# Altium schematic sheet Schematic.SchDoc: IoT Color Detection
size B; ApprovedBy: Abbas; CheckedBy: Abbas; Author: Abbas; DrawnBy: Abbas; Revision: V1; SheetNumber: 1; SheetTotal: 1
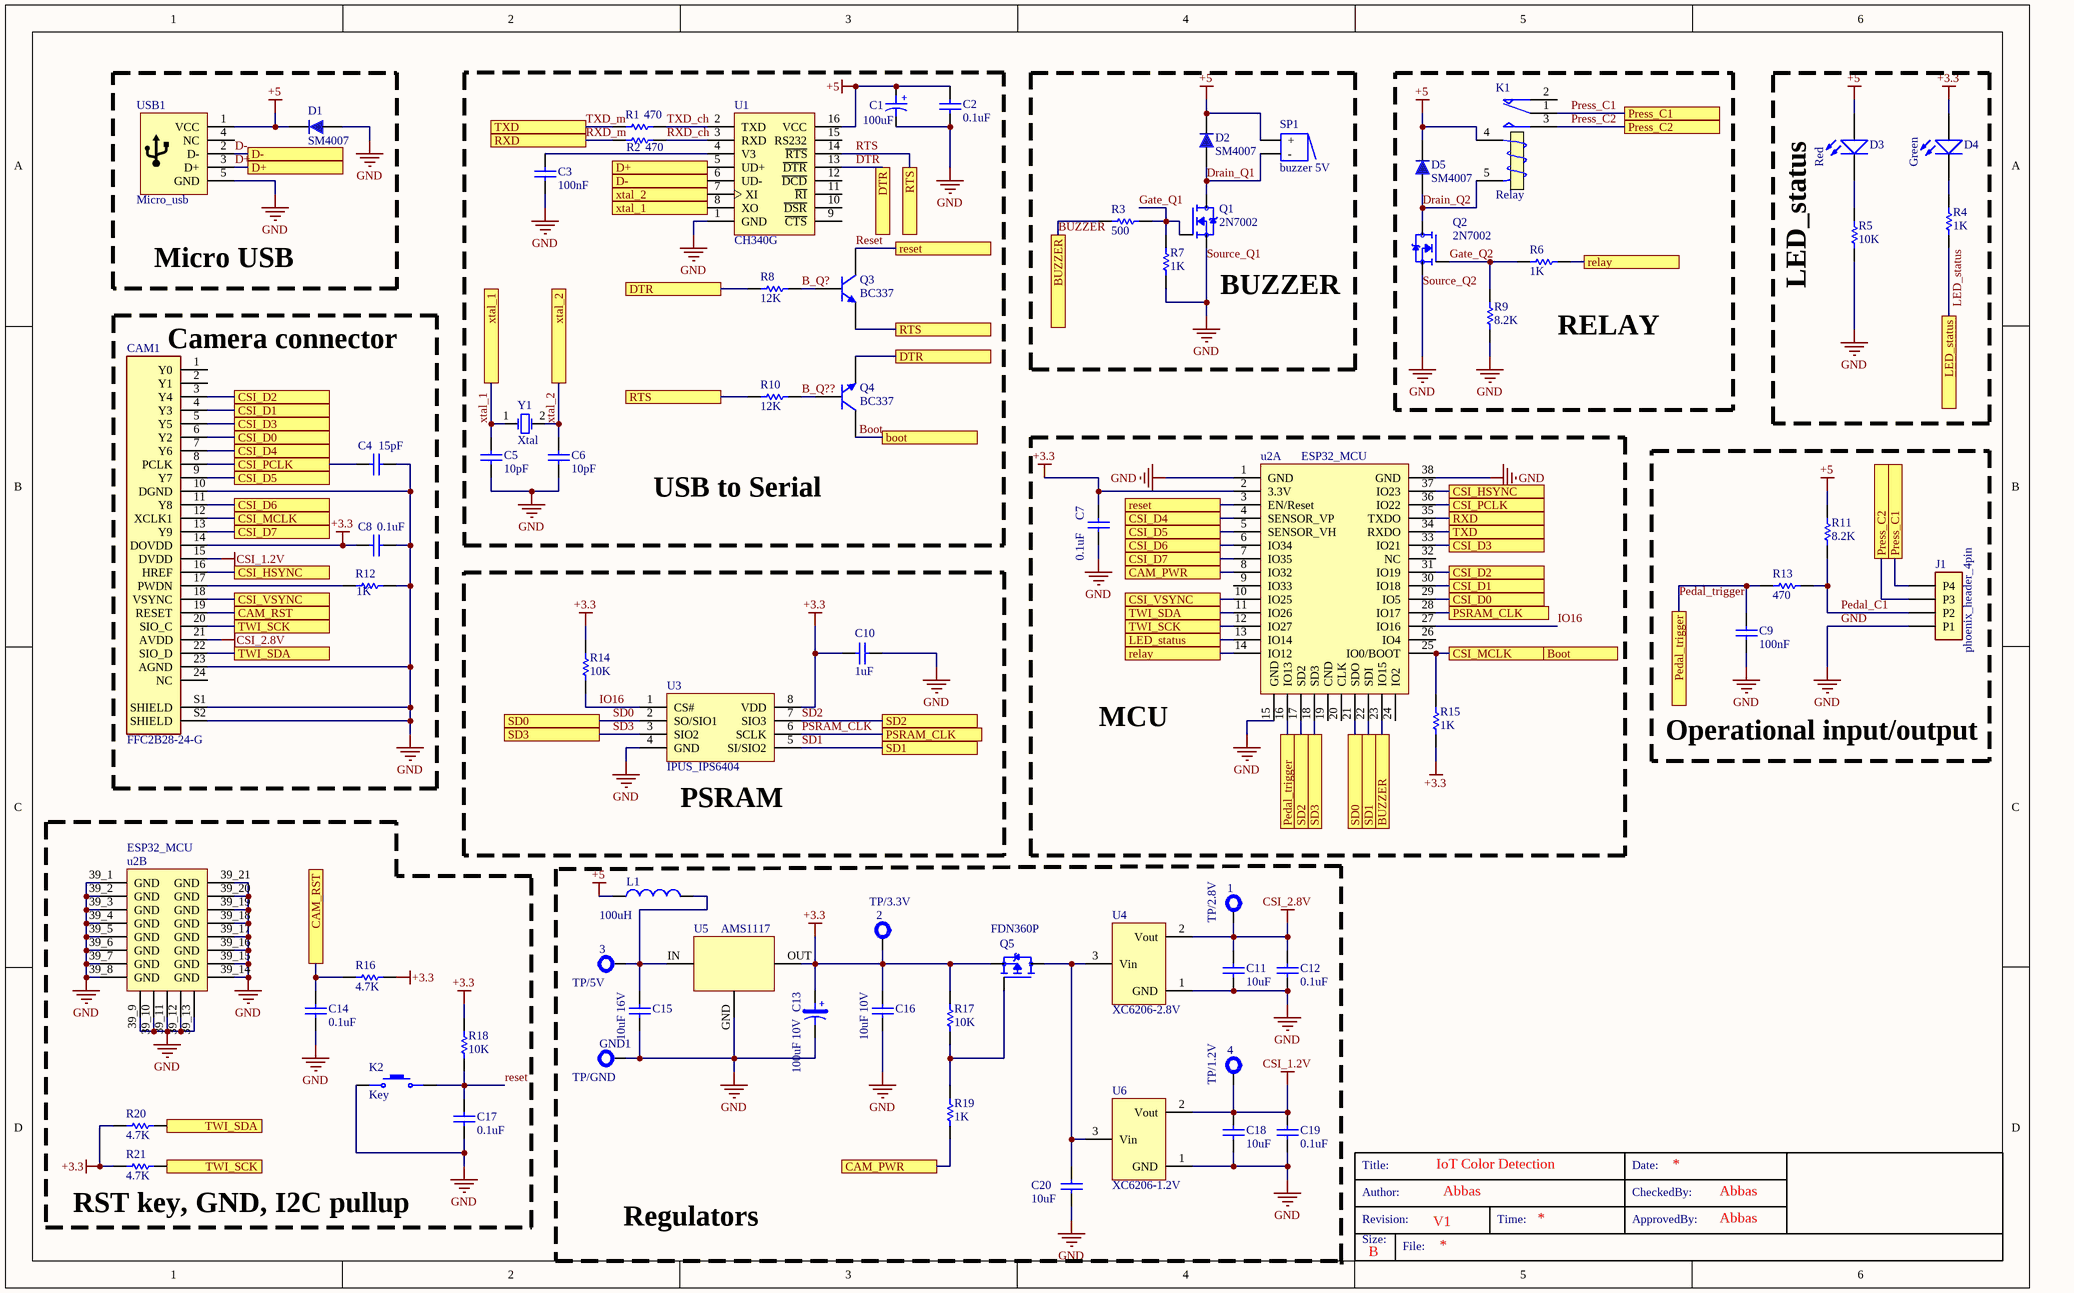
[diagram p0: Schematic.SchDoc]

## Parts
1  TP/2.8V  [test_point]
2  TP/3.3V  [test_point]
3  TP/5V  [test_point]
4  TP/1.2V  [test_point]
C1  100uF  [TH_electrolite]
C2  0.1uF  [SMD_1206]
C3  100nF  [SMD_1206]
C4  15pF  [SMD_0805]
C5  10pF  [SMD_0805]
C6  10pF  [SMD_0805]
C7  0.1uF  [SMD_1206]
C8  0.1uF  [SMD_0805]
C9  100nF  [SMD_1206]
C10  1uF  [SMD_1206]
C11  10uF  [SMD_1206]
C12  0.1uF  [SMD_1206]
C13  100uF 10V  [B size (1210)]
C14  0.1uF  [SMD_1206]
C15  10uF 16V  [SMD_1206]
C16  10uF 10V  [SMD_1206]
C17  0.1uF  [SMD_1206]
C18  10uF  [SMD_1206]
C19  0.1uF  [SMD_1206]
C20  10uF  [SMD_1206]
CAM1  FFC2B28-24-G  [FFC_24pin_smd]
D1  SM4007  [SOD-123F]
D2  SM4007  [SOD-123F]
D3  Red  [LED_SMD_1206]
D4  Green  [LED_SMD_1206]
D5  SM4007  [SOD-123F]
GND1  TP/GND  [test_point]
J1  phoenix_header_4pin  [phoenix_header_4pin]
K1  Relay  [relay_milon]
K2  Key  [key smd]
L1  100uH  [Indicator_DIP]
Q1  2N7002  [SOT23-3L]
Q2  2N7002  [SOT23-3L]
Q3  BC337  [SOT23-3L]
Q4  BC337  [SOT23-3L]
Q5  FDN360P  [SOT23-3L]
R1  470  [resistor 1206]
R2  470  [resistor 1206]
R3  500  [resistor 1206]
R4  1K  [resistor 1206]
R5  10K  [resistor 1206]
R6  1K  [resistor 1206]
R7  1K  [resistor 1206]
R8  12K  [resistor 1206]
R9  8.2K  [resistor 1206]
R10  12K  [resistor 1206]
R11  8.2K  [resistor 1206]
R12  1K  [resistor 1206]
R13  470  [resistor 1206]
R14  10K  [resistor 1206]
R15  1K  [resistor 1206]
R16  4.7K  [resistor 1206]
R17  10K  [resistor 1206]
R18  10K  [resistor 1206]
R19  1K  [resistor 1206]
R20  4.7K  [resistor 1206]
R21  4.7K  [resistor 1206]
SP1  buzzer 5V  [BUZZER]
U1  CH340G  [SOP_16]
u2  ESP32_MCU  [38-SMD Module]  (parts A,B of 2)
U3  IPUS_IPS6404  [SOP-8]
U4  XC6206-2.8V  [SOT23-3L]
U5  AMS1117  [SOT-223]
U6  XC6206-1.2V  [SOT23-3L]
USB1  Micro_usb  [micro_usb_smd]
Y1  Xtal  [xtal]

## Blocks framed on the sheet
Micro USB: D1 USB1
USB to Serial: C1-C3 C5 C6 Q3 Q4 R1 R2 R8 R10 U1 Y1
BUZZER: D2 Q1 R3 R7 SP1
RELAY: D5 K1 Q2 R6 R9
LED_status: D3 D4 R4 R5
Camera connector: C4 C8 CAM1 R12
MCU: C7 R15 u2
Operational input/output: C9 J1 R11 R13
PSRAM: C10 R14 U3
RST key, GND, I2C pullup: C14 C17 K2 R16 R18 R20 R21 u2
Regulators: 1-4 C11-C13 C15 C16 C18-C20 GND1 L1 Q5 R17 R19 U4-U6

## Ports
Boot (see Schematic[3B]), boot (see Schematic[5C]), BUZZER (see Schematic[4B]), BUZZER (see Schematic[5C]), CAM_PWR (see Schematic[3D]), CAM_PWR (see Schematic[4B]), CAM_RST (see Schematic[1B]), CAM_RST (see Schematic[1C]), CSI_D0 (see Schematic[1B]), CSI_D0 (see Schematic[5B]), CSI_D1 (see Schematic[1B]), CSI_D1 (see Schematic[5B]), CSI_D2 (see Schematic[1B]), CSI_D2 (see Schematic[5B]), CSI_D3 (see Schematic[1B]), CSI_D3 (see Schematic[5B]), CSI_D4 (see Schematic[1B]), CSI_D4 (see Schematic[4B]), CSI_D5 (see Schematic[1B]), CSI_D5 (see Schematic[4B]), CSI_D6 (see Schematic[1B]), CSI_D6 (see Schematic[4B]), CSI_D7 (see Schematic[1B]), CSI_D7 (see Schematic[4B]), CSI_HSYNC (see Schematic[1B]), CSI_HSYNC (see Schematic[5B]), CSI_MCLK (see Schematic[1B]), CSI_MCLK (see Schematic[5C]), CSI_PCLK (see Schematic[1B]), CSI_PCLK (see Schematic[5B]), CSI_VSYNC (see Schematic[1B]), CSI_VSYNC (see Schematic[4B]), D+ (see Schematic[1A]), D+ (see Schematic[2A]), D- (see Schematic[1A]), D- (see Schematic[2A]), DTR (see Schematic[2A], Schematic[3A]), DTR (see Schematic[2A], Schematic[3B]), DTR (see Schematic[3A], Schematic[3B]), LED_status (see Schematic[4B]), LED_status (see Schematic[6B]), Pedal_trigger (see Schematic[4C]), Pedal_trigger (see Schematic[5C]), Press_C1 (see Schematic[5A]), Press_C1 (see Schematic[6B]), Press_C2 (see Schematic[5A]), Press_C2 (see Schematic[6B]), PSRAM_CLK (see Schematic[3C]), PSRAM_CLK (see Schematic[5B]), relay (see Schematic[4C]), relay (see Schematic[5A]), reset (see Schematic[3A]), reset (see Schematic[4B]), RTS (see Schematic[2B], Schematic[3A]), RTS (see Schematic[2B], Schematic[3B]), RTS (see Schematic[3A], Schematic[3B]), RXD (see Schematic[2A]), RXD (see Schematic[5B]), SD0 (see Schematic[2C]), SD0 (see Schematic[5C]), SD1 (see Schematic[3C]), SD1 (see Schematic[5C]), SD2 (see Schematic[3C]), SD2 (see Schematic[4C]), SD3 (see Schematic[2C]), SD3 (see Schematic[4C]), TWI_SCK (see Schematic[1B], Schematic[1D]), TWI_SCK (see Schematic[1B], Schematic[4B]), TWI_SCK (see Schematic[1D], Schematic[4B]), TWI_SDA (see Schematic[1C], Schematic[1D]), TWI_SDA (see Schematic[1C], Schematic[4B]), TWI_SDA (see Schematic[1D], Schematic[4B]), TXD (see Schematic[2A]), TXD (see Schematic[5B]), xtal_1 (see Schematic[2A]), xtal_1 (see Schematic[2B]), xtal_2 (see Schematic[2A]), xtal_2 (see Schematic[2B])

## Nets
+3.3: 2.1 C7.1 C8.2 C10.2 C13.1 C16.1 CAM1.14(DOVDD) D4.2(A) Q5.2(S) R14.1 R15.1 R16.2 R17.2 R18.2 R20.2 R21.2 u2.2(3.3V) U3.8(VDD) U5.OUT
+5: C1.1 C2.1 D1.2 D2.2 D3.2(A) D5.2 K1.4(T1) L1.1 R11.1 SP1.1(+) U1.16(VCC) USB1.1(VCC)
CSI_1.2V: 4.1 C18.1 C19.1 CAM1.15(DVDD) U6.2(Vout)
CSI_2.8V: 1.1 C11.1 C12.1 CAM1.21(AVDD) U4.2(Vout)
GND: C1.2 C2.2 C3.2 C4.1 C5.1 C6.1 C7.2 C8.1 C9.2 C10.1 C11.2 C12.2 C13.2 C14.2 C15.2 C16.2 C17.2 C18.2 C19.2 C20.2 CAM1.10(DGND) CAM1.23(AGND) CAM1.S1(SHIELD) CAM1.S2(SHIELD) D1.1 GND1.1 J1.P1 K2.1 Q1.2(S) Q2.2(S) R5.1 R7.1 R9.1 R12.1 U1.1(GND) u2.1(GND) u2.15(GND) u2.38(GND) u2.39_1(GND) u2.39_2(GND) u2.39_3(GND) u2.39_4(GND) u2.39_5(GND) u2.39_6(GND) u2.39_7(GND) u2.39_8(GND) u2.39_9(GND) u2.39_10(GND) u2.39_11(GND) u2.39_12(GND) u2.39_13(GND) u2.39_14(GND) u2.39_15(GND) u2.39_16(GND) u2.39_17(GND) u2.39_18(GND) u2.39_19(GND) u2.39_20(GND) u2.39_21(GND) U3.4(GND) U4.1(GND) U5.GND U6.1(GND) USB1.5(GND)  [also labelled Source_Q1, Source_Q2]
B_Q?: Q3.2(B) R8.1
B_Q??: Q4.2(B) R10.1
Boot: CAM1.12(XCLK1) Q4.1(E) R15.2 u2.25(IO0/BOOT) ; port boot, port CSI_MCLK, port Boot
BUZZER: R3.2 u2.23(IO15) ; port BUZZER
CAM_PWR: R19.1 u2.8(IO32) ; port CAM_PWR
CAM_RST: C14.1 CAM1.19(RESET) R16.1 ; port CAM_RST
CSI_D0: CAM1.6(Y2) u2.29(IO5) ; port CSI_D0
CSI_D1: CAM1.4(Y3) u2.30(IO18) ; port CSI_D1
CSI_D2: CAM1.3(Y4) u2.31(IO19) ; port CSI_D2
CSI_D3: CAM1.5(Y5) u2.33(IO21) ; port CSI_D3
CSI_D4: CAM1.7(Y6) u2.4(SENSOR_VP) ; port CSI_D4
CSI_D5: CAM1.9(Y7) u2.5(SENSOR_VH) ; port CSI_D5
CSI_D6: CAM1.11(Y8) u2.6(IO34) ; port CSI_D6
CSI_D7: CAM1.13(Y9) u2.7(IO35) ; port CSI_D7
CSI_HSYNC: CAM1.16(HREF) u2.37(IO23) ; port CSI_HSYNC
CSI_PCLK: C4.2 CAM1.8(PCLK) u2.36(IO22) ; port CSI_PCLK
CSI_VSYNC: CAM1.18(VSYNC) u2.10(IO25) ; port CSI_VSYNC
D+: U1.5(UD+) USB1.3(D+) ; port D+
D-: U1.6(UD-) USB1.2(D-) ; port D-
Drain_Q1: D2.1 Q1.3(D) SP1.2(-)
Drain_Q2: D5.1 K1.5(T2) Q2.3(D)
DTR: Q4.3(C) R8.2 U1.13(~{DTR}) ; port DTR
Gate_Q1: Q1.1(G) R3.1 R7.2
Gate_Q2: Q2.1(G) R6.1 R9.2
IO16: R14.2 u2.27(IO16) U3.1(CS#)
LED_status: R4.1 u2.13(IO14) ; port LED_status
Pedal_C1: J1.P2 R11.2 R13.1
Pedal_trigger: C9.1 R13.2 u2.16(IO13) ; port Pedal_trigger
Press_C1: J1.P4 K1.1(COM) ; port Press_C1
Press_C2: J1.P3 K1.3(NO) ; port Press_C2
PSRAM_CLK: u2.28(IO17) U3.6(SCLK) ; port PSRAM_CLK
relay: R6.2 u2.14(IO12) ; port relay
Reset: C17.1 K2.2 Q3.1(E) R18.1 u2.3(EN/Reset) ; port reset
RTS: Q3.3(C) R10.2 U1.14(~{RTS}) ; port RTS
RXD_ch: R2.1 U1.3(RXD)
RXD_m: R2.2 u2.35(TXDO) ; port RXD
SD0: u2.21(SDO) U3.2(SO/SIO1) ; port SD0
SD1: u2.22(SDI) U3.5(SI/SIO2) ; port SD1
SD2: u2.17(SD2) U3.7(SIO3) ; port SD2
SD3: u2.18(SD3) U3.3(SIO2) ; port SD3
TWI_SCK: CAM1.20(SIO_C) R21.1 u2.12(IO27) ; port TWI_SCK
TWI_SDA: CAM1.22(SIO_D) R20.1 u2.11(IO26) ; port TWI_SDA
TXD_ch: R1.1 U1.2(TXD)
TXD_m: R1.2 u2.34(RXDO) ; port TXD
xtal_1: C5.2 U1.8(XO) Y1.1(OSC1) ; port xtal_1
xtal_2: C6.2 U1.7(XI) Y1.2(OSC2) ; port xtal_2
Net3_1: 3.1 C15.1 L1.2 U5.IN
NetC3_1: C3.1 U1.4(V3)
NetC20_1: C20.1 Q5.3(D) U4.3(Vin) U6.3(Vin)
NetCAM1_17: CAM1.17(PWDN) R12.2
NetD3_1: D3.1(K) R5.2
NetD4_1: D4.1(K) R4.2
NetQ5_1: Q5.1(G) R17.1 R19.2

Not connected (* = marked no-connect by the designer): CAM1 1(Y0) 2(Y1) 24(NC); K1 2(NC); U1 9(~{CTS}) 10(~{DSR}) 11(~{RI}) 12(~{DCD}) 15(RS232); u2 9(IO33) 19(CND) 20(CLK) 24(IO2) 26(IO4) 32(NC); USB1 4(NC)

## Notes on the sheet
- Title:
- Date:
- Size:
- Author:
- Revision:
- Time:
- CheckedBy:
- ApprovedBy:
- B
- File:
- (in symbol Cap) +
- (in symbol tantalium_cap_D_size) +

## Library data of the parts
1-4 GND1 = test_point
C1 = Cap: Cap electrolitic radial 6x7-2.5
C2-C12 C14-C20 = cap ceramic
C13 = tantalium_cap_D_size
CAM1 = FFC2B28-24-G: 24 Position FFC, FPC Connector Contacts, Top and Bottom 0.020 (0.50mm) Surface Mount, Right Angle
D3 D4 = LED_SMD_1206
J1 = phoenix_header_4pin: Pluggable terminal block; socket; male; 3.5mm; angled 90Â°; ways: 4
L1 = Indicator DIP
Q5 = FDN360P: P-Channel 30V 2A (Ta) 500mW (Ta) Surface Mount SuperSOT-3
R1-R21 = Resistor 1206
U3 = IPUS_IPS6404: PSRAM ESP32CAM
U4 U6 = XC6206